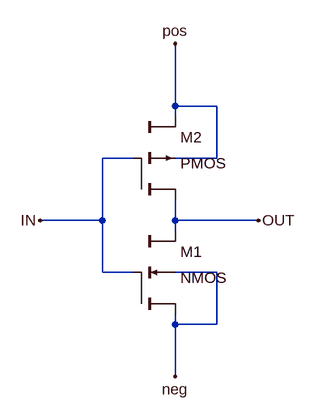
[diagram p0: schematic Inverter.asc]
Inverter.asc, the LTspice schematic file:
Version 4
SHEET 1 880 680
WIRE 240 32 240 -64
WIRE 304 32 240 32
WIRE 240 48 240 32
WIRE 176 112 128 112
WIRE 304 112 304 32
WIRE 304 112 240 112
WIRE 128 208 128 112
WIRE 128 208 32 208
WIRE 240 208 240 176
WIRE 368 208 240 208
WIRE 240 224 240 208
WIRE 128 288 128 208
WIRE 176 288 128 288
WIRE 304 288 240 288
WIRE 240 368 240 352
WIRE 304 368 304 288
WIRE 304 368 240 368
WIRE 240 448 240 368
FLAG 32 208 IN
FLAG 368 208 OUT
FLAG 240 -64 pos
FLAG 240 448 neg
SYMBOL cktsym\\nmos4 240 288 R0
SYMATTR InstName M1
SYMATTR Value2 l=.9u w=3u
SYMBOL cktsym\\pmos4 240 112 R0
SYMATTR InstName M2
SYMATTR Value2 l=.9u w=6u

The netlist it stands for:
* Inverter.asc
M1 OUT IN neg neg NMOS l=.9u w=3u
M2 OUT IN pos pos PMOS l=.9u w=6u
.model NMOS NMOS
.model PMOS PMOS
.lib standard.mos
.backanno
.end